# EAGLE design LED_Lampe_v01 (EAGLE 6.2)
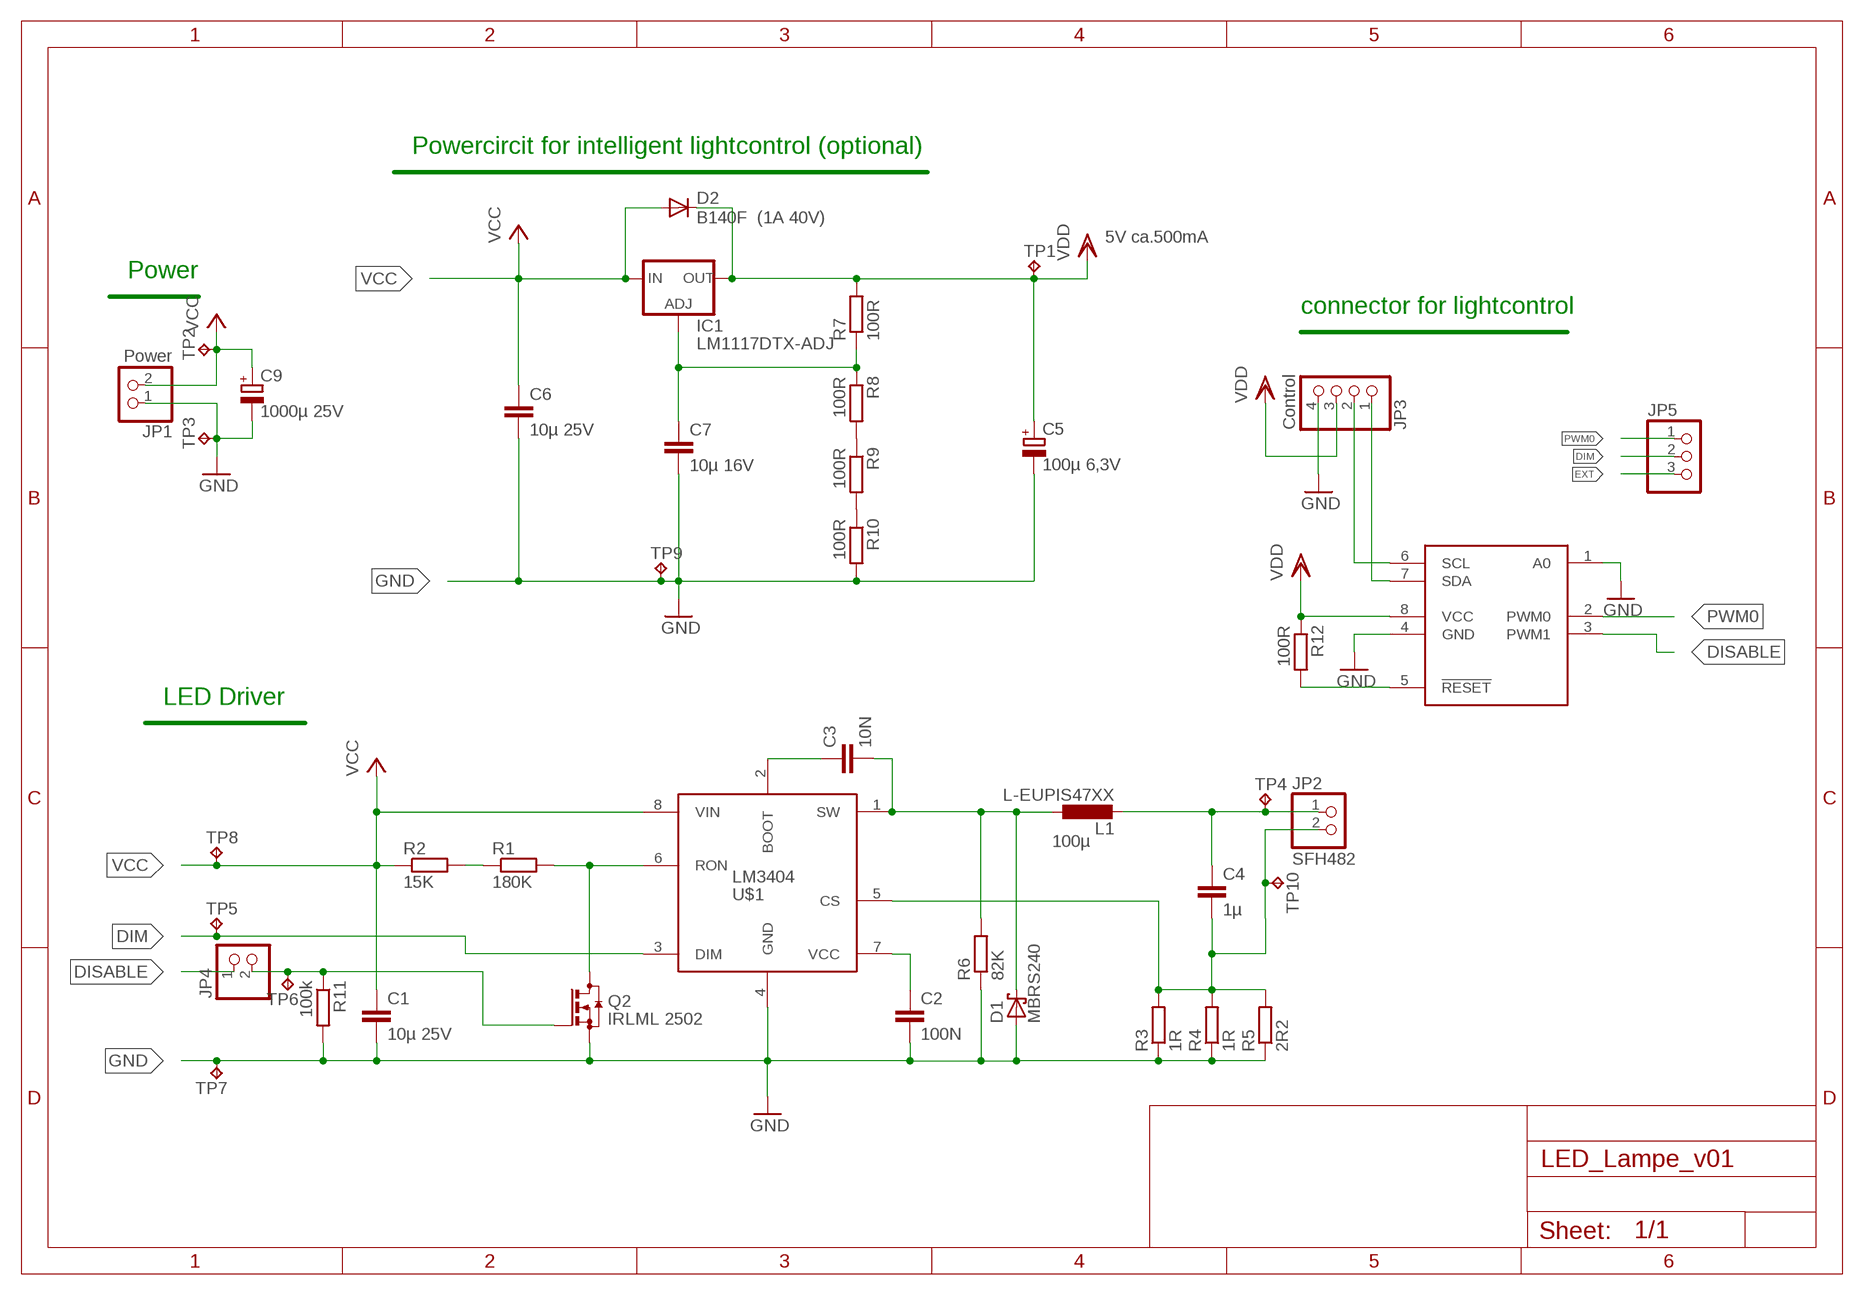
[diagram p0: schematic, sheet 1]

## Parts
C1  10µ 25V  C-EUC1206  [C1206]
C2  100N  C-EUC0805  [C0805]
C3  10N  C-EUC0805  [C0805]
C4  1µ  C-EUC0805  [C0805]
C5  100µ 6,3V  CPOL-EUSMCD  [SMC_D]
C6  10µ 25V  C-EUC1206  [C1206]
C7  10µ 16V  C-EUC1206  [C1206]
C9  1000µ 25V  CPOL-EU153CLV-1014  [153CLV-1014]
D1  MBRS240  MBRS130LT3  [SMB]
D2  B140F (1A 40V)  DIODE-DO214AC  [DO214AC]
IC1  LM1117DTX-ADJ  [TO252]
JP1  Power  PINHD-1X2_2.54-SMD-90°  [1X02SMD/90]
JP2  SFH482  PINHD-1X2_2.54-SMD-90°  [1X02SMD/90]
JP3  Control  PINHD-1X4_2.54-SMD-90°  [1X04SMD/90]
JP4  PINHD-1X2_2.54  [1X02]
JP5  PINHD-1X3_2.54  [1X03]
L1  L-EUPIS47XX  [PIS47XX]
Q2  IRLML 2502  BSS123  [SOT23]
R1  180K  R-EU_R0805  [R0805]
R2  15K  R-EU_R0805  [R0805]
R3  1R  R-EU_R0805  [R0805]
R4  1R  R-EU_R0805  [R0805]
R5  2R2  R-EU_R0805  [R0805]
R6  82K  R-EU_R0805  [R0805]
R7  100R  R-EU_R0805  [R0805]
R8  100R  R-EU_R0805  [R0805]
R9  100R  R-EU_R0805  [R0805]
R10  100R  R-EU_R0805  [R0805]
R11  100k  R-EU_R0805  [R0805]
R12  100R  R-EU_R0805  [R0805]
TP1  TP-040  [TP-040]
TP2  TP-040  [TP-040]
TP3  TP-040  [TP-040]
TP4  TP-040  [TP-040]
TP5  TP-040  [TP-040]
TP6  TP-040  [TP-040]
TP7  TP-040  [TP-040]
TP8  TP-040  [TP-040]
TP9  TP-040  [TP-040]
TP10  TP-040  [TP-040]
U$1  LM3404  [SO-8]
U$2  PCA9530  [SO08]

## Nets
BLAAA: C5.+ D2.C IC1.TAB(OUT) JP3.3 R7.2 R12.1 TP1.1 U$2.8(VCC) ; supply symbol labelled VDD
DABLE: JP4.2 Q2.1(G) R11.1 TP6.1
DIM: JP5.2 TP5.1 U$1.3(DIM)
DISABLE: JP4.1 U$2.3(PWM1)
EXT: JP5.3
GND: C1.2 C2.2 C5.- C6.2 C7.2 C9.- D1.A JP1.1 JP3.4 Q2.2(S) R3.1 R4.1 R5.1 R6.1 R10.2 R11.2 TP3.1 TP7.1 TP9.1 U$1.4(GND) U$2.1(A0) U$2.4(GND)
N$1: R1.1 R2.2
N$2: Q2.3(D) R1.2 U$1.6(RON)
N$5: C2.1 U$1.7(VCC)
N$6: C4.1 JP2.1 L1.1 TP4.1
N$7: C3.1 U$1.2(BOOT)
N$8: C3.2 D1.C L1.2 R6.2 U$1.1(SW)
N$9: C4.2 JP2.2 R3.2 R4.2 R5.2 TP10.1 U$1.5(CS)
N$10: R12.2 U$2.5(!RESET)
N$11: JP3.1 U$2.7(SDA)
N$12: R8.2 R9.1
N$13: R9.2 R10.1
N$14: C7.1 IC1.1(ADJ) R7.1 R8.1
PWM0: JP5.1 U$2.2(PWM0)
SCL: JP3.2 U$2.6(SCL)
VCC: C1.1 C6.1 C9.+ D2.A IC1.2(IN) JP1.2 R2.1 TP2.1 TP8.1 U$1.8(VIN)

## Notes on the sheet
- Powercircit for intelligent lightcontrol (optional)
- 5V ca.500mA
- Power
- connector for lightcontrol
- LED Driver
- 100µ

## Library data of the parts
C1-C4 C6 C7 = resistor:C-EU: CAPACITOR, European symbol
C5 C9 = resistor:CPOL-EU: POLARIZED CAPACITOR, European symbol
D1 = diode:MBRS130LT3: Schottky Power Rectifier Source: http://www.onsemi.com/pub/Collateral/MBRS130LT3-D.PDF
D2 = diode:DIODE-: DIODE
IC1 = lm1117:LM1117DTX-ADJ
JP1 JP2 = pinhead:PINHD-1X2: PIN HEADER
JP3 = pinhead:PINHD-1X4: PIN HEADER
JP4 = pinhead-1:PINHD-1X2: PIN HEADER
JP5 = pinhead-1:PINHD-1X3: PIN HEADER
L1 = Inductor-Fastron:L-EU
Q2 = transistor-small-signal:BSS123: N-CHANNEL MOS FET
R1-R12 = resistor:R-EU_: RESISTOR, European symbol
TP1-TP10 = keystone:TP: TEST POINT PCB Vertical Mount
U$1 = lm3404:LM3404
U$2 = i2c:PCA9530: PCA9530 reichelt artikel <http://www.reichelt.de/PCF-I-C-Bus-Controller/PCA-9530-D/index.html?ACTION=3&GROUPID=2942&ARTICLE=70041&SHOW=1&START=0&OFFSET=16&> Datasheet <http://www.reichelt.de/index.html?;ACTION=7;LA=3;OPEN=0;INDEX=0;FILENAME=A300%252FPCA9530_NXP.pdf;SID=12T1yO@n8AAAIAADlrqfgabe290d911dc58dbb81ff659898db174>

## Board
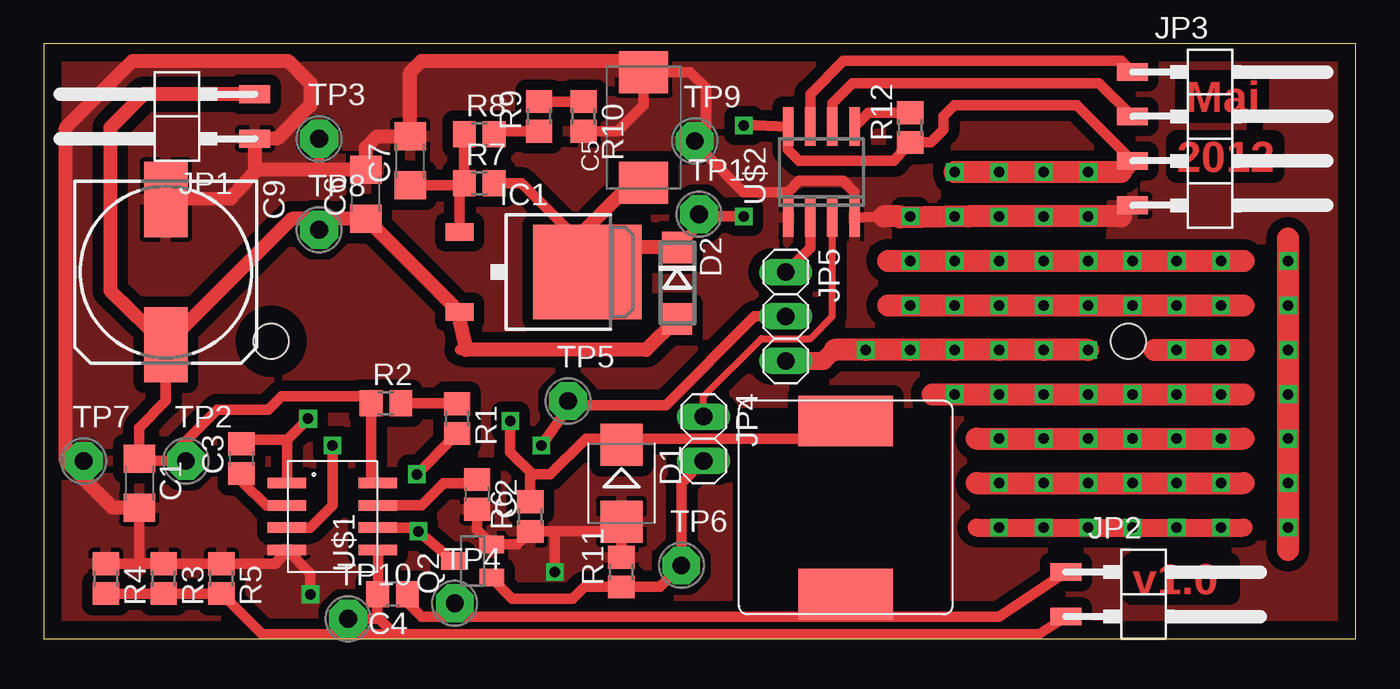
[diagram p1: board, top side]
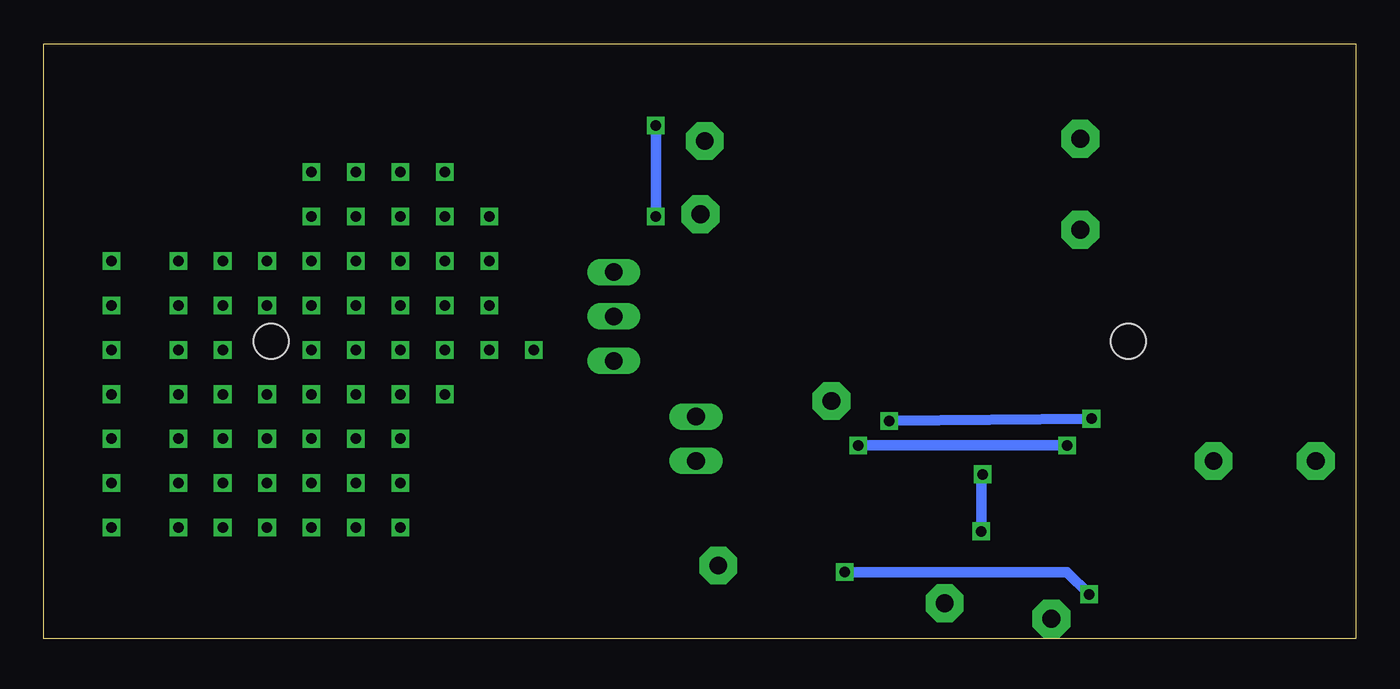
[diagram p2: board, bottom side, seen from below]

Size 75 x 34 mm. Coordinates in mm from the lower left corner, seen from the top.
Outline: 0,0 75,0 75,34 0,34 0,0
Copper layers (1*16): Top 0.035mm / dielectric 1.5mm / Bottom 0.035mm
Design rules: minimum track width 10mil, minimum drill 24mil, track to track 8mil, track to pad 8mil, pad to pad 8mil, via to via 8mil, smd to smd 8mil, copper to edge 40mil, drill to drill 8mil, minimum pad ring 10mil, minimum via ring 8mil, stop-mask expansion 4mil, vias tented up to drill 0mil, thermal gap 10mil
Holes 2 mm at 13,17 62,17
tRestrict: area 40,1.9 to 51.2,12.6

### Footprints (pad centres in the part's own frame; a part is rotated, then mirrored left to right if it is on the bottom)
C1206 = smd 1.6 x 1.8: 1 -1.4,0; 2 1.4,0
C0805 = smd 1.3 x 1.5: 1 -0.85,0; 2 0.85,0
SMC_D = smd 2.4 x 2.8: + -3.15,0; - 3.15,0
153CLV-1014 = smd 4.3 x 2.5: + 4.15,0; - -4.15,0
SMB = smd 2.4 x 2.4: A 2.2,0; C -2.2,0
DO214AC = smd 1.8 x 1.7: A 2.05,0; C -2.05,0
TO252 = smd 1 x 1.6: 1 -2.28,-4.8; 2 2.28,-4.8 | smd 5.4 x 6.2: TAB 0,2.5
1X02SMD/90 = smd 1.016 x 1.778: 1 -1.27,-5.08; 2 1.27,-5.08
1X04SMD/90 = smd 1.016 x 1.778: 1 -1.27,-5.08; 2 1.27,-5.08; 3 3.81,-5.08; 4 6.35,-5.08
1X02 = drill 1.016 long: 1 -1.27,0; 2 1.27,0
1X03 = drill 1.016 long: 1 -2.54,0; 2 0,0; 3 2.54,0
PIS47XX = smd 2.9 x 5.4: 1 -4.95,0; 2 4.95,0
SOT23 = smd 1 x 1.4: 1 -0.95,-1.1; 2 0.95,-1.1; 3 0,1.1
R0805 = smd 1.3 x 1.5: 1 -0.85,0; 2 0.85,0
TP-040 = drill 1.016 pad 2.159 octagon: 1 0,0
SO-8 = smd 2.2 x 0.6: 1 -2.6,2.54; 2 -2.6,1.27; 3 -2.6,0; 4 -2.6,-1.27; 5 2.6,-1.27; 6 2.6,0; 7 2.6,1.27; 8 2.6,2.54
SO08 = smd 0.6 x 2.2: 1 -1.905,-2.6; 2 -0.635,-2.6; 3 0.635,-2.6; 4 1.905,-2.6; 5 1.905,2.6; 6 0.635,2.6; 7 -0.635,2.6; 8 -1.905,2.6

### Placement (x,y rotation side)
C1  5.46,8.89 270 top
C2  24.77,8.26 270 top
C3  11.3,10.29 90 top
C4  19.94,2.54 180 top
C5  34.29,29.21 90 top
C6  18.41,25.4 90 top
C7  20.95,27.3 90 top
C9  6.99,20.95 270 top
D1  33.02,8.89 270 top
D2  36.2,20.32 270 top
IC1  28.57,20.95 270 top
JP1  6.99,29.84 90 top
JP2  63.5,2.54 270 top
JP3  67.31,31.11 270 top
JP4  37.72,11.43 270 top
JP5  42.42,18.41 270 top
L1  45.85,7.49 90 top
Q2  24.51,4.45 90 top
R1  23.62,12.57 270 top
R2  19.56,13.46 0 top
R3  6.86,3.43 270 top
R4  3.56,3.43 270 top
R5  10.16,3.43 270 top
R6  27.81,6.99 90 top
R7  24.89,26.04 0 top
R8  24.89,28.83 0 top
R9  28.32,29.84 90 top
R10  30.86,29.84 270 top
R11  33.02,3.81 90 top
R12  49.53,29.21 90 top
TP1  37.47,24.26 0 top
TP2  8.13,10.16 0 top
TP3  15.75,28.57 0 top
TP4  23.5,2.03 0 top
TP5  29.97,13.59 0 top
TP6  36.45,4.19 0 top
TP7  2.29,10.16 0 top
TP8  15.75,23.37 0 top
TP9  37.21,28.45 0 top
TP10  17.4,1.14 0 top
U$1  16.51,6.35 0 top
U$2  44.45,26.67 0 top

### Tracks (layer width: path | path; a pad name or v marks a point on that pad's centre or on a via)
BLAAA  (via drill 0.6)
  Top 0.61: 29.99,19.87 30.46,20.34 | 30.46,20.34 IC1.TAB | R7.2 27.3,26.04 30.46,22.88 30.46,20.34 | D2.C 37.95,24.13 38.1,24.13 | JP3.3 59.05,30.48 52.07,30.48 51.44,29.84 51.44,29.08 50.71,28.36 R12.1 48.6,27.3 43.18,27.3 42.55,27.94 U$2.8 40.7,29.34 v40.01,29.34 | 38.1,24.13 v40.01,24.13 | TP1.1 37.97,24.26 38.1,24.13
  Top 0.813: 30.46,22.88 33.64,26.06 C5.+ | D2.C 32.49,22.37 IC1.TAB
  Top 1.016: JP3.3 61.59,26.67
  Top 1.27: 61.59,26.67 52.07,26.67
  Bottom 0.61: v40.01,24.13 v40.01,29.34
DABLE
  Top 0.61: Q2.1 26.78,2.29 30.23,2.29 30.9,2.96 R11.1 35.22,2.96 TP6.1 36.45,8.89 JP4.2
DIM  (via drill 0.6)
  Top 0.61: U$1.3 15.24,6.35 16.51,7.62 v16.51,11.05 | v28.45,11.05 30.1,13.34 | 30.1,13.34 35.56,13.34 40.64,18.41 JP5.2 | TP5.1 29.97,13.46 30.1,13.34
  Bottom 0.61: v16.51,11.05 v28.45,11.05
DISABLE
  Top 0.406: JP4.1 37.72,13.84 41.02,17.14 43.81,17.14 45.09,18.41 U$2.3
EXT  (via drill 0.6)
  Top 1.016: JP5.3 44.58,15.88 45.21,16.51
  Top 1.27: 59.69,16.51 v57.15,16.51 v54.61,16.51 v52.07,16.51 v49.53,16.51 v46.99,16.51 45.21,16.51
GND  (via drill 0.6)
  Top 0.61: 11.98,26.58 12.06,26.71 12.15,26.8 | R10.2 32.8,29 34.29,30.48 C5.- 36.96,32.38 37.85,31.5 37.85,27.94 | R4.1 6.35,4.28 | 6.35,4.28 R3.1 R5.1 13.24,4.28 U$1.4 15.24,3.75 v15.24,2.54 | C1.2 5.46,4.32 6.35,4.32 6.35,4.28 | 29.21,6.13 R6.1 27.07,5.39 Q2.2 24.77,6.24 C2.2 | 29.21,6.13 32.8,6.13 | 32.8,6.13 33.02,6.35 D1.A | R11.2 33.02,5.92 32.8,6.13 | v29.21,3.81 29.21,6.13 | U$2.1 42.55,25.53 | 42.55,25.53 43.18,26.16 45.72,26.16 46.35,25.53 U$2.4 48.01,24.13 | JP3.4 61.59,24.13 | 42.55,25.53 40.01,25.53 37.85,27.69 37.85,27.94 | TP7.1 1.27,10.16 | TP3.1 15.75,26.8 | TP9.1 37.34,28.45 37.85,27.94
  Top 0.813: 12.06,26.71 JP1.1 13.34,28.57 15.24,30.48 15.24,31.75 13.97,33.02 5.08,33.02 1.27,29.21 1.27,10.16 3.94,7.49 C1.2 | 11.98,26.58 10.67,25.15 C9.- | 12.15,26.8 15.75,26.8 C6.2 18.41,28.07 19.05,28.7 20.83,28.7 20.95,28.57 20.95,32.38 21.59,33.02 33.63,33.02 C5.-
  Top 1.27: 61.59,24.13 52.83,24.13 48.96,24.07 48.96,24.13 48.01,24.13
  Bottom 0.61: v15.24,2.54 16.51,3.81 v29.21,3.81
  pour Top (isolate 0.61): 0,34.29 0,0 74.93,0 74.93,34.29
N$1
  Top 0.61: R2.2 23.58,13.46 R1.1
N$2  (via drill 0.6)
  Top 0.61: U$1.6 21.17,6.35 v21.41,6.14 Q2.3 | v21.34,9.4 23.33,11.43 R1.2
  Bottom 0.61: v21.34,9.4 21.41,8.71 v21.41,6.14
N$4
  pour Top (isolate 0.61): 0,34.29 0,0 68.58,0 68.58,34.29
N$5
  Top 0.61: U$1.7 21.59,7.62 22.86,8.89 24.55,8.89 C2.1
N$6
  Top 0.61: C4.1 20.79,2.07 21.59,1.27 22.86,1.27 | 22.86,1.27 46.99,1.27 | 46.99,1.27 54.61,1.27 JP2.1 | L1.1 46.35,1.91 46.99,1.27 | TP4.1 23.5,1.91 22.86,1.27
N$7
  Top 0.61: U$1.2 12.7,7.62 11.43,8.89 11.43,9.31 C3.1
N$8  (via drill 0.6)
  Top 0.61: R6.2 27.81,9.27 27.94,9.4 | 27.94,9.4 28.96,9.4 30.99,11.43 32.68,11.43 D1.C 33.02,11.43 44.33,11.43 L1.2 | U$1.1 13.91,11.37 | 13.91,11.37 v15.11,12.57 | v26.67,12.45 26.67,10.67 27.94,9.4 | C3.2 11.54,11.37 13.91,11.37
  Bottom 0.61: v15.11,12.57 v26.67,12.45
N$9
  Top 0.61: R4.2 R3.2 R5.2 12.48,0.25 20.07,0.25 | 18.92,2.54 18.99,2.6 | 18.99,2.6 19.05,2.67 | U$1.5 19.11,2.81 C4.2 | JP2.2 56.9,0.25 20.07,0.25 | 20.07,0.25 19.05,1.27 | 19.05,1.27 19.05,2.5 C4.2 | TP10.1 18.92,1.14 19.05,1.27 | C4.2 19.05,2.54 18.99,2.6
N$10
  Top 0.61: R12.2 47.15,30.06 U$2.5
N$11
  Top 0.61: JP3.1 61.59,33.02 45.72,33.02 43.81,31.11 U$2.7
N$12
  Top 0.61: R8.2 25.91,29 R9.1
N$13
  Top 0.61: R9.2 R10.1
N$14
  Top 0.61: R8.1 R7.1 | C7.1 23.91,25.91 R7.1 | R7.1 23.77,25.77 IC1.1
N$15  (via drill 0.6)
  other vias: 71.12,6.35
N$16
  Top 1.016: 53.34,6.35 68.58,6.35
N$17  (via drill 0.6)
  other vias: 54.61,6.35
N$18  (via drill 0.6)
  other vias: 57.15,6.35
N$19  (via drill 0.6)
  other vias: 59.69,6.35
N$20  (via drill 0.6)
  other vias: 62.23,6.35
N$21  (via drill 0.6)
  other vias: 64.77,6.35
N$22  (via drill 0.6)
  other vias: 67.31,6.35
N$23  (via drill 0.6)
  other vias: 54.61,8.89
N$24  (via drill 0.6)
  other vias: 57.15,8.89
N$25  (via drill 0.6)
  other vias: 59.69,8.89
N$26  (via drill 0.6)
  other vias: 62.23,8.89
N$27  (via drill 0.6)
  other vias: 64.77,8.89
N$28  (via drill 0.6)
  other vias: 67.31,8.89
N$29  (via drill 0.6)
  other vias: 71.12,8.89
N$30
  Top 1.27: 53.34,8.89 68.58,8.89
N$31  (via drill 0.6)
  other vias: 54.61,11.43
N$32  (via drill 0.6)
  other vias: 57.15,11.43
N$33  (via drill 0.6)
  other vias: 59.69,11.43
N$34  (via drill 0.6)
  other vias: 62.23,11.43
N$35  (via drill 0.6)
  other vias: 64.77,11.43
N$36  (via drill 0.6)
  other vias: 67.31,11.43
N$37  (via drill 0.6)
  other vias: 71.12,11.43
N$38
  Top 1.27: 53.34,11.43 68.58,11.43
N$39  (via drill 0.6)
  other vias: 54.61,13.97
N$40  (via drill 0.6)
  other vias: 57.15,13.97
N$41  (via drill 0.6)
  other vias: 59.69,13.97
N$42  (via drill 0.6)
  other vias: 62.23,13.97
N$43  (via drill 0.6)
  other vias: 64.77,13.97
N$44  (via drill 0.6)
  other vias: 67.31,13.97
N$45  (via drill 0.6)
  other vias: 71.12,13.97
N$46  (via drill 0.6)
  Top 1.27: 50.8,13.97 v52.07,13.97 68.58,13.97
N$47  (via drill 0.6)
  other vias: 54.61,19.05
N$48  (via drill 0.6)
  other vias: 57.15,19.05
N$49  (via drill 0.6)
  other vias: 59.69,19.05
N$50  (via drill 0.6)
  Top 1.27: 63.5,16.51 v64.77,16.51 v67.31,16.51 68.58,16.51
N$51  (via drill 0.6)
  other vias: 64.77,19.05
N$52  (via drill 0.6)
  other vias: 67.31,19.05
N$53  (via drill 0.6)
  other vias: 71.12,19.05
N$54  (via drill 0.6)
  Top 1.27: 48.26,19.05 v49.53,19.05 v52.07,19.05 v62.23,19.05 68.58,19.05
N$55  (via drill 0.6)
  other vias: 54.61,21.59
N$56  (via drill 0.6)
  other vias: 57.15,21.59
N$57  (via drill 0.6)
  other vias: 59.69,21.59
N$58  (via drill 0.6)
  other vias: 62.23,21.59
N$59  (via drill 0.6)
  other vias: 64.77,21.59
N$60  (via drill 0.6)
  other vias: 67.31,21.59
N$61  (via drill 0.6)
  other vias: 71.12,21.59
N$62  (via drill 0.6)
  Top 1.27: 48.26,21.59 v49.53,21.59 v52.07,21.59 68.58,21.59
N$63  (via drill 0.6)
  other vias: 49.53,24.13
N$64  (via drill 0.6)
  other vias: 59.69,16.51
N$65  (via drill 0.6)
  other vias: 52.07,24.13
N$66  (via drill 0.6)
  other vias: 54.61,24.13
N$67  (via drill 0.6)
  other vias: 57.15,24.13
N$68  (via drill 0.6)
  other vias: 59.69,24.13
N$69  (via drill 0.6)
  other vias: 71.12,16.51
N$70  (via drill 0.6)
  other vias: 59.69,26.67
N$71  (via drill 0.6)
  other vias: 57.15,26.67
N$72  (via drill 0.6)
  other vias: 54.61,26.67
N$73  (via drill 0.6)
  other vias: 52.07,26.67
N$74
  Top 1.27: 71.12,22.86 71.12,5.08
PWM0
  Top 0.61: JP5.1 43.81,22.35 U$2.2
SCL
  Top 0.61: JP3.2 60.33,31.75 46.23,31.75 45.09,30.61 U$2.6
VCC
  Top 0.61: 23.81,16.51 24.07,16.77 | C9.+ 6.99,13.59 5.46,12.06 C1.1 5.59,10.16 7.62,10.16 | TP2.1 7.62,10.16 | 7.62,10.16 7.62,10.79 9.91,13.08 12.83,13.08 13.59,13.84 18.33,13.84 R2.1 18.71,9.29 U$1.8 | TP8.1 15.75,23.49 15.24,24
  Top 0.813: JP1.2 5.71,31.11 3.81,29.21 3.81,19.9 C9.+ 14.18,24 15.24,24 C6.1 23.74,18.68 IC1.2 23.77,18.14 24.07,16.77 24.13,16.51 34.44,16.51 D2.A

### Text on the board
Top: Mai | 2012 | v1.0